# EAGLE design whoop-v2.0-F3 (EAGLE 6.4)
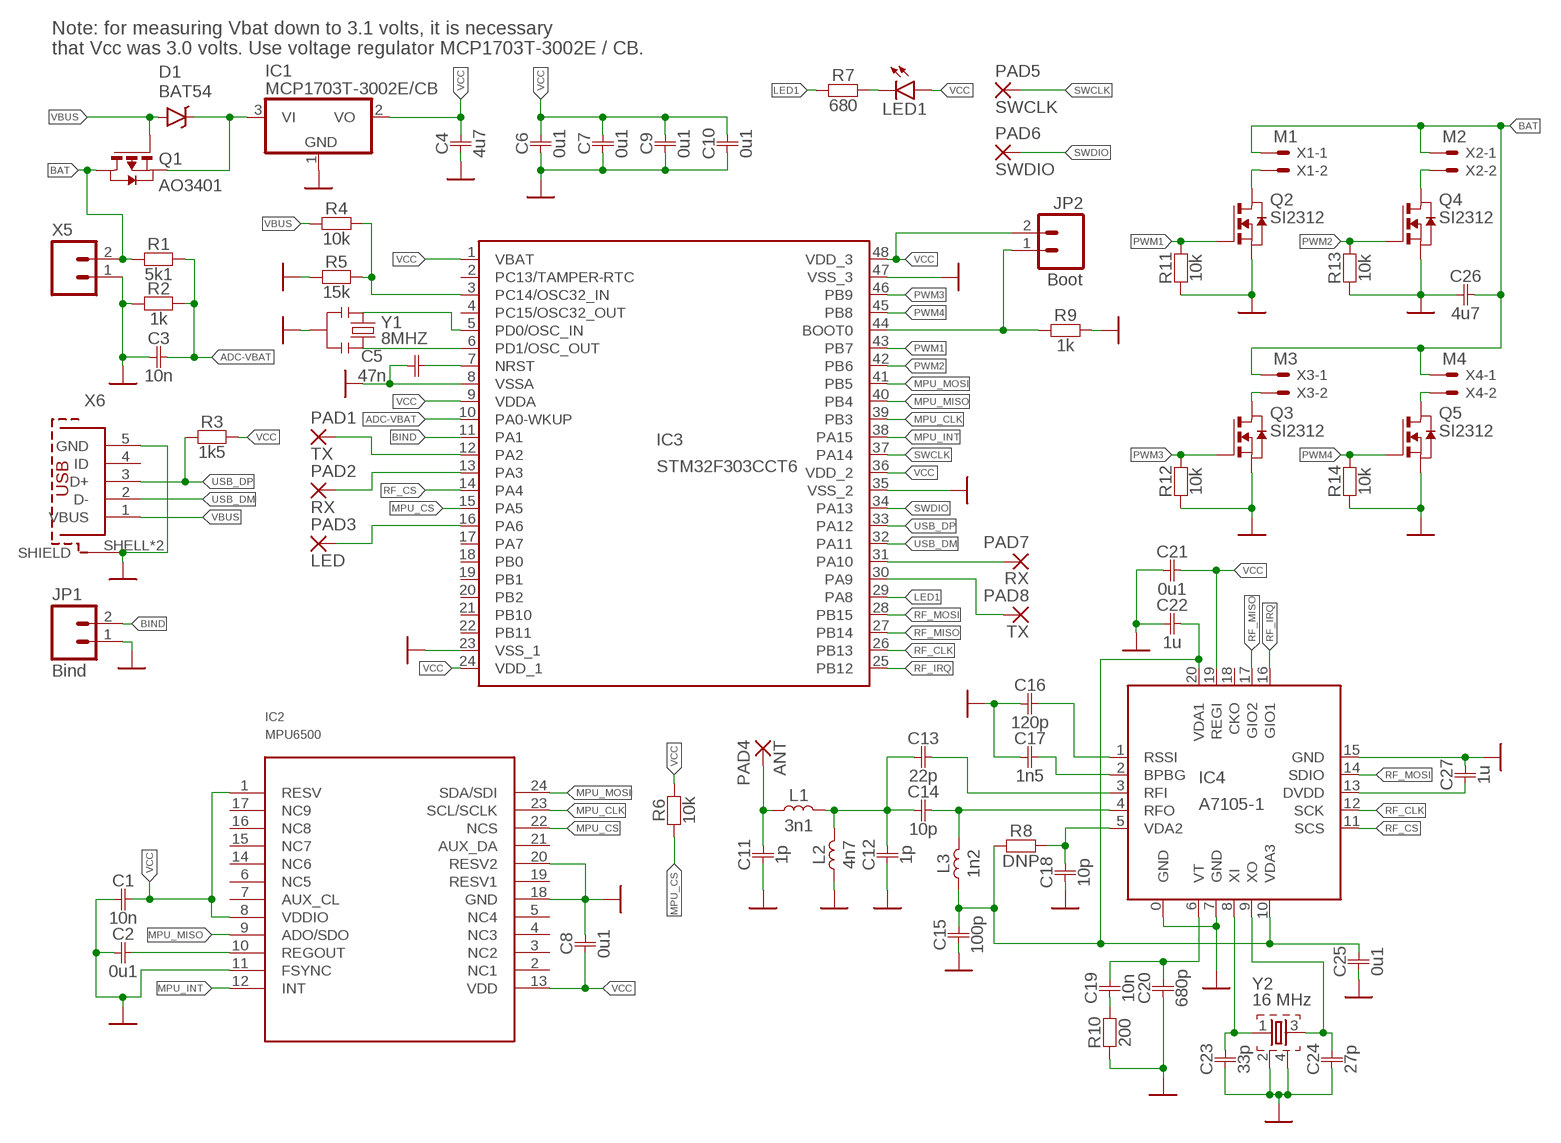
[diagram p0: schematic, sheet 1]

## Parts
C1  10n  C0402  [0402]
C2  0u1  C0402  [0402]
C3  10n  C0402  [0402]
C4  4u7  C0805  [0805]
C5  47n  C0402  [0402]
C6  0u1  C0402  [0402]
C7  0u1  C0402  [0402]
C8  0u1  C0402  [0402]
C9  0u1  C0402  [0402]
C10  0u1  C0402  [0402]
C11  1p  C0402  [0402]
C12  1p  C0402  [0402]
C13  22p  C0402  [0402]
C14  10p  C0402  [0402]
C15  100p  C0402  [0402]
C16  120p  C0402  [0402]
C17  1n5  C0402  [0402]
C18  10p  C0402  [0402]
C19  10n  C0402  [0402]
C20  680p  C0402  [0402]
C21  0u1  C0402  [0402]
C22  1u  C0402  [0402]
C23  33p  C0402  [0402]
C24  27p  C0402  [0402]
C25  0u1  C0402  [0402]
C26  4u7  C0805  [0805]
C27  1u  C0402  [0402]
D1  BAT54  BAT20JFILM  [SOD-323]
IC1  MCP1703T-3002E/CB  MCP1703CB  [SOT23]
IC2  MPU6500  MPU-9250  [LEAD-QFN24]
IC3  STM32F303CCT6  STM32F103C8  [LQFP48]
IC4  A7105-1  [QFN20-1]
JP1  Bind  M021.27MM  [1X02_1.27MM]
JP2  Boot  M021.27MM  [1X02_1.27MM]
L1  3n1  L0402  [0402]
L2  4n7  L0402  [0402]
L3  1n2  L0402  [0402]
LED1  LED-RED0603  [LED-0603]
PAD1  TX  SMD2SMD-R0,635  [SMD_R0,635]
PAD2  RX  1/0,6  [1/0,6]
PAD3  LED  1/0,6  [1/0,6]
PAD4  ANT  1/0,6  [1/0,6]
PAD5  SWCLK  SMD2SMD-R0,635  [SMD_R0,635]
PAD6  SWDIO  SMD2SMD-R0,635  [SMD_R0,635]
PAD7  RX  1/0,6  [1/0,6]
PAD8  TX  1/0,6  [1/0,6]
Q1  AO3401  PMOSSOT23  [SOT-23]
Q2  SI2312  NMOSSOT23  [SOT-23]
Q3  SI2312  NMOSSOT23  [SOT-23]
Q4  SI2312  NMOSSOT23  [SOT-23]
Q5  SI2312  NMOSSOT23  [SOT-23]
R1  5k1  R0402  [0402]
R2  1k  R0402  [0402]
R3  1k5  R0402  [0402]
R4  10k  R0402  [0402]
R5  15k  R0402  [0402]
R6  10k  R0402  [0402]
R7  680  R0402  [0402]
R8  DNP  R0402  [0402]
R9  1k  R0402  [0402]
R10  200  R0402  [0402]
R11  10k  R0402  [0402]
R12  10k  R0402  [0402]
R13  10k  R0402  [0402]
R14  10k  R0402  [0402]
X1  M1  53047-02  [53047-02]
X2  M2  53047-02  [53047-02]
X3  M3  53047-02  [53047-02]
X4  M4  53047-02  [53047-02]
X5  M022MM  [1X02_2MM]
X6  614105150721  [614105150721]
Y1  8MHZ  RESONATOR8MHZ  [RESONATOR-SMD]
Y2  16 MHz  FA-3225  [FA-20H]

## Nets
ADC-VBAT: C3.P$2 IC3.10(PA0-WKUP) R1.P$1 R2.P$1
BAT: C26.P$2 Q1.1(D) R1.P$2 X1.1 X2.1 X3.1 X4.1 X5.2
BIND: IC3.11(PA1) JP1.2
GND: C1.P$1 C2.P$1 C3.P$1 C4.P$1 C5.P$1 C6.P$1 C7.P$1 C8.P$2 C9.P$1 C10.P$1 C11.P$1 C12.P$1 C15.P$1 C16.P$1 C17.P$1 C18.P$1 C20.P$1 C21.P$1 C22.P$1 C23.P$1 C24.P$1 C25.P$1 C26.P$1 C27.P$2 IC1.1(GND) IC2.11(FSYNC) IC2.18(GND) IC2.20(RESV2) IC3.8(VSSA) IC3.23(VSS_1) IC3.35(VSS_2) IC3.47(VSS_3) IC4.0(GND) IC4.7(GND) IC4.15(GND) JP1.1 L2.P$1 Q2.2(S) Q3.2(S) Q4.2(S) Q5.2(S) R2.P$2 R5.P$2 R9.P$2 R10.P$1 R11.P$1 R12.P$1 R13.P$1 R14.P$1 X5.1 X6.5(GND) X6.SHELL1(SHIELD) X6.SHELL(SHIELD) Y1.2 Y2.2 Y2.4
LED1: IC3.29(PA8) R7.P$1
M1+: Q2.1(D) X1.2
M2+: Q4.1(D) X2.2
M3+: Q3.1(D) X3.2
M4+: Q5.1(D) X4.2
MPU_CLK: IC2.23(SCL/SCLK) IC3.39(PB3)
MPU_CS: IC2.22(NCS) IC3.15(PA5) R6.P$1
MPU_INT: IC2.12(INT) IC3.38(PA15)
MPU_MISO: IC2.9(ADO/SDO) IC3.40(PB4)
MPU_MOSI: IC2.24(SDA/SDI) IC3.41(PB5)
N$1: C13.P$2 IC4.3(RFI)
N$2: C12.P$2 C13.P$1 C14.P$1 L1.P$2 L2.P$2
N$3: C2.P$2 IC2.10(REGOUT)
N$4: C14.P$2 IC4.4(RFO) L3.P$1
N$5: C23.P$2 IC4.8(XI) Y2.1
N$6: C24.P$2 IC4.9(XO) Y2.3
N$7: C17.P$2 IC4.2(BPBG)
N$8: C16.P$2 IC4.1(RSSI)
N$9: C19.P$2 C20.P$2 IC4.6(VT)
N$10: C27.P$1 IC4.13(DVDD)
N$11: C19.P$1 R10.P$2
N$12: C15.P$2 C22.P$2 C25.P$2 IC4.10(VDA3) IC4.20(VDA1) L3.P$2 R8.P$1
N$13: IC3.6(PD1/OSC_OUT) Y1.3
N$14: C18.P$2 IC4.5(VDA2) R8.P$2
N$15: LED1.C R7.P$2
N$16: IC3.12(PA2) PAD1.1(P)
N$17: IC3.3(PC14/OSC32_IN) R4.P$2 R5.P$1
N$18: IC3.13(PA3) PAD2.1(P)
N$19: IC3.44(BOOT0) JP2.1 R9.P$1
N$20: C11.P$2 L1.P$1 PAD4.1(P)
N$21: IC3.31(PA10) PAD7.1(P)
N$22: IC3.16(PA6) PAD3.1(P)
N$23: IC3.30(PA9) PAD8.1(P)
N$33: IC3.5(PD0/OSC_IN) Y1.1
N$36: D1.C IC1.3(VI) Q1.2(S)
N$37: C5.P$2 IC3.7(NRST)
PWM1: IC3.43(PB7) Q2.3(G) R11.P$2
PWM2: IC3.42(PB6) Q4.3(G) R13.P$2
PWM3: IC3.46(PB9) Q3.3(G) R12.P$2
PWM4: IC3.45(PB8) Q5.3(G) R14.P$2
RF_CLK: IC3.26(PB13) IC4.12(SCK)
RF_CS: IC3.14(PA4) IC4.11(SCS)
RF_IRQ: IC3.25(PB12) IC4.16(GIO1)
RF_MISO: IC3.27(PB14) IC4.17(GIO2)
RF_MOSI: IC3.28(PB15) IC4.14(SDIO)
SWCLK: IC3.37(PA14) PAD5.1(P)
SWDIO: IC3.34(PA13) PAD6.1(P)
USB_DM: IC3.32(PA11) X6.2(D-)
USB_DP: IC3.33(PA12) R3.P$2 X6.3(D+)
VBUS: D1.A Q1.3(G) R4.P$1 X6.1(VBUS)
VCC: C1.P$2 C4.P$2 C6.P$2 C7.P$2 C8.P$1 C9.P$2 C10.P$2 C21.P$2 IC1.2(VO) IC2.1(RESV) IC2.8(VDDIO) IC2.13(VDD) IC3.1(VBAT) IC3.9(VDDA) IC3.24(VDD_1) IC3.36(VDD_2) IC3.48(VDD_3) IC4.19(REGI) JP2.2 LED1.A R3.P$1 R6.P$2
Unconnected: IC2.2(NC1) IC2.3(NC2) IC2.4(NC3) IC2.5(NC4) IC2.6(NC5) IC2.7(AUX_CL) IC2.14(NC6) IC2.15(NC7) IC2.16(NC8) IC2.17(NC9) IC2.19(RESV1) IC2.21(AUX_DA) IC3.2(PC13/TAMPER-RTC) IC3.4(PC15/OSC32_OUT) IC3.17(PA7) IC3.18(PB0) IC3.19(PB1) IC3.20(PB2) IC3.21(PB10) IC3.22(PB11) IC4.18(CKO) X6.4(ID)

## Notes on the sheet
- Note: for measuring Vbat down to 3.1 volts, it is necessary
  that Vcc was 3.0 volts. Use voltage regulator MCP1703T-3002E / CB.

## Library data of the parts
C1-C27 = RC.v2:C
D1 = SparkFun-DiscreteSemi:BAT20JFILM: 23V, 1A Schottky diode, SOD-323 package; PROD_ID: DIO-11623; VALUE: BAT20JFILM
IC1 = semi:MCP1703: 250 mA, 16V, Low Quiescent Current LDO Regulator Source: http://ww1.microchip.com/downloads/en/DeviceDoc/22049b.pdf
IC2 = invensense:MPU-9250
IC3 = cc3d:STM32F103C8: STM32F103C8 edit this description Auto generated by make-symbol-device-package-bsdl.ulp Rev. 43 Source: STM32F103C8.txt
IC4 = A7105:A7105
JP1 JP2 X5 = conn:M02: Standard 2-pin 0.1" header. Use with - straight break away headers ( PRT-00116) - right angle break away headers (PRT-00553) - swiss pins (PRT-00743) - machine pins (PRT-00117) - female headers (PRT-00115) Molex polarized connector foot print use with: PRT-08233 with associated crimp pins and housings. 2.54_SCREWTERM for use with PRT-10571. 3.5mm Screw Terminal footprints for PRT-08084 5mm Screw Terminal footprints for use with PRT-08432
L1-L3 = RC.v2:L
LED1 = led:LED-RED: Assorted Red LEDs LilyPad 1206- DIO-09912 1206- DIO-00809 0603- DIO-00819; PROD_ID: DIO-00819; VALUE: RED
PAD1 PAD5 PAD6 = pad:SMD2: SMD PAD
PAD2-PAD4 PAD7 PAD8 = pad:1/0,6
Q1 = cc3d:PMOSSOT23: MOS FET; OC_FARNELL: unknown; OC_NEWARK: unknown
Q2-Q5 = cc3d:NMOSSOT23: MOS FET; OC_FARNELL: unknown; OC_NEWARK: unknown
R1-R14 = RC.v2:R
X1-X4 = con-molex:53?-02: CONNECTOR wire to board 1.25 mm (.049 inch) pitch header; MF: MOLEX; MPN: 53047-0210; OC_FARNELL: 9733051; OC_NEWARK: 57H4701
X6 = micro-usb:614105150721: WR-COM_USB_Micro Type B_Vertical_THT; Micro Type B Vertical THT- Tape & Reel not for Pick & Place machine Code : Con_I-O_COM_USB_2.0_B_614105150721_614105150721 <http://katalog.we-online.de/media/images/eican/Con_I-O_COM_USB_2.0_B_614105150721_pf2.jpg> Details see: http://katalog.we-online.de/em/datasheet/614105150721.pdf Created 12/08/2014, Dan Xu 2014 (C) Wurth Elektronik
Y1 = resonator:RESONATOR: Resonator Small SMD resonator. Used, eg, on the Arduino Pro/ Pro Mini boards. 8MHz- XTAL-08895 16MHz- XTAL-08900; PROD_ID: XTAL-08895
Y2 = thermo:FA-: MHz RANGE CRYSTAL UNIT Source: Epson Toyocom

## Board
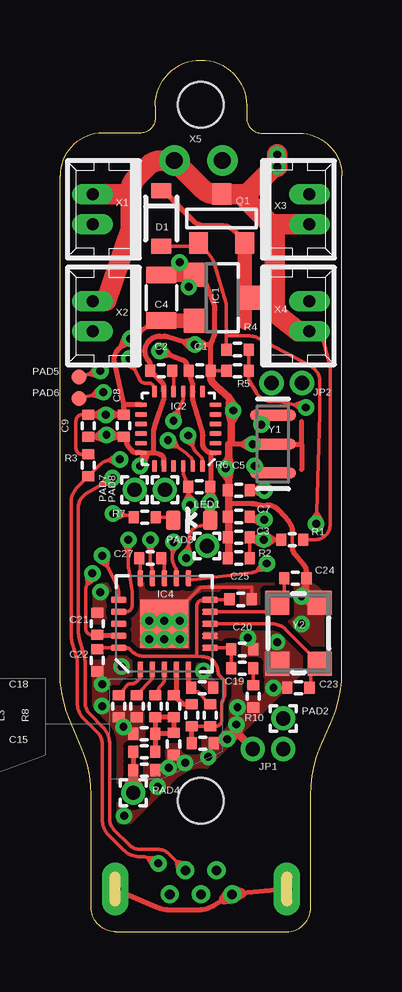
[diagram p1: board, top side]
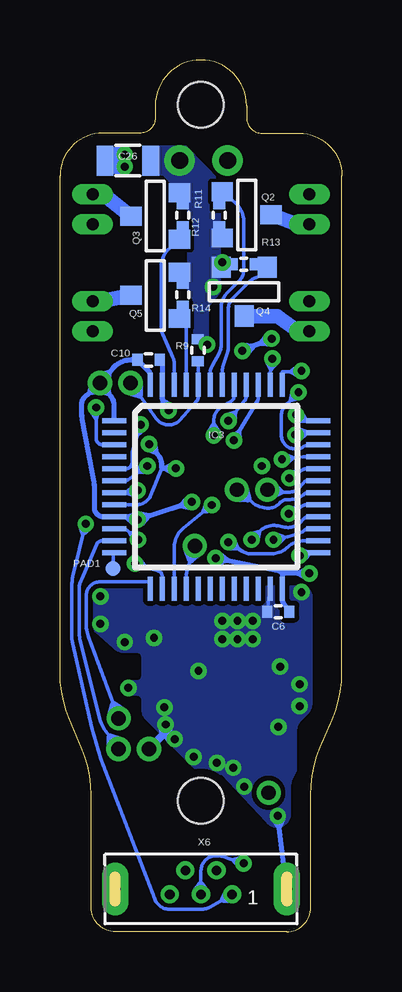
[diagram p2: board, bottom side, seen from below]

Size 11.75 x 36.32 mm. Coordinates in mm from the lower left corner, seen from the top.
Outline: 8.41,33.27 9.97,33.27 arc-90 11.75,31.5 11.75,10.82 arc-23 11.34,8.82 10.85,7.69 arc23 10.45,5.69 10.45,1 arc-90 9.45,0 2.3,0 arc-90 1.3,1 1.3,5.69 arc23 0.89,7.69 0.41,8.82 arc-23 0,10.82 0,31.5 arc-90 1.78,33.27 3.33,33.27 arc90 3.97,33.91 3.97,34.42 arc-180 7.78,34.42 7.78,33.91 arc90 8.41,33.27
Copper layers (1*16): Top 0.0356mm / dielectric 1.5011mm / Bottom 0.0356mm
Design rules "oshpark-2layer": minimum track width 6mil, minimum drill 13mil, track to track 6mil, track to pad 6mil, pad to pad 6mil, via to via 6mil, smd to smd 6mil, copper to edge 15mil, drill to drill 6mil, minimum pad ring 7mil, minimum via ring 7mil, stop-mask expansion 0mil, vias tented up to drill 30mil, thermal gap 10mil
Holes 1.9 mm at 5.87,34.46 5.87,5.46

### Footprints (pad centres in the part's own frame; a part is rotated, then mirrored left to right if it is on the bottom)
0402 = smd 0.42 x 0.5: P$1 -0.46,0; P$2 0.46,0
0805 = smd 0.7 x 1.25: P$1 -0.95,0; P$2 0.95,0
SOD-323 = smd 0.63 x 0.83: A 1.15,0; C -1.15,0
SOT23 = smd 1 x 1: 1 -0.95,-1.1; 2 0.95,-1.1; 3 0,1.1
LEAD-QFN24 = smd 0.5 x 0.2: 1 -1.549,1; 2 -1.549,0.6; 3 -1.549,0.2; 4 -1.549,-0.2; 5 -1.549,-0.6; 6 -1.549,-1; 13 1.549,-1; 14 1.549,-0.6; 15 1.549,-0.2; 16 1.549,0.2; 17 1.549,0.6; 18 1.549,1 | smd 0.2 x 0.5: 7 -1,-1.549; 8 -0.6,-1.549; 9 -0.2,-1.549; 10 0.2,-1.549; 11 0.6,-1.549; 12 1,-1.549; 19 1,1.549; 20 0.6,1.549; 21 0.2,1.549; 22 -0.2,1.549; 23 -0.6,1.549; 24 -1,1.549
LQFP48 = smd 0.2 x 1: 1 -2.75,-4.25; 2 -2.25,-4.25; 3 -1.75,-4.25; 4 -1.25,-4.25; 5 -0.75,-4.25; 6 -0.25,-4.25; 7 0.25,-4.25; 8 0.75,-4.25; 9 1.25,-4.25; 10 1.75,-4.25; 11 2.25,-4.25; 12 2.75,-4.25; 25 2.75,4.25; 26 2.25,4.25; 27 1.75,4.25; 28 1.25,4.25; 29 0.75,4.25; 30 0.25,4.25; 31 -0.25,4.25; 32 -0.75,4.25; 33 -1.25,4.25; 34 -1.75,4.25; 35 -2.25,4.25; 36 -2.75,4.25 | smd 1 x 0.2: 13 4.25,-2.75; 14 4.25,-2.25; 15 4.25,-1.75; 16 4.25,-1.25; 17 4.25,-0.75; 18 4.25,-0.25; 19 4.25,0.25; 20 4.25,0.75; 21 4.25,1.25; 22 4.25,1.75; 23 4.25,2.25; 24 4.25,2.75; 37 -4.25,2.75; 38 -4.25,2.25; 39 -4.25,1.75; 40 -4.25,1.25; 41 -4.25,0.75; 42 -4.25,0.25; 43 -4.25,-0.25; 44 -4.25,-0.75; 45 -4.25,-1.25; 46 -4.25,-1.75; 47 -4.25,-2.25; 48 -4.25,-2.75
QFN20-1 = smd 2 x 2: 0 0,0 | smd 0.65 x 0.25: 1 -1.9,1; 2 -1.9,0.5; 3 -1.9,0; 4 -1.9,-0.5; 5 -1.9,-1; 11 1.9,-1; 12 1.9,-0.5; 13 1.9,0; 14 1.9,0.5; 15 1.9,1 | smd 0.25 x 0.65: 6 -1,-1.9; 7 -0.5,-1.9; 8 0,-1.9; 9 0.5,-1.9; 10 1,-1.9; 16 1,1.9; 17 0.5,1.9; 18 0,1.9; 19 -0.5,1.9; 20 -1,1.9
1X02_1.27MM = drill 0.6 pad 1.016: 1 0,0; 2 1.27,0
LED-0603 = smd 0.8 x 0.6: A 0,-0.777; C 0,0.777
SMD_R0,635 = smd 0.635 x 0.635: 1 0,0
1/0,6 = drill 0.6 pad 1: 1 0,0
SOT-23 = smd 0.787 x 0.889: 1 0.025,-1.016; 2 -0.94,1.016; 3 0.991,1.016
53047-02 = drill 0.5 pad 0.698 long: 1 0.625,0.45; 2 -0.625,0.45
1X02_2MM = drill 0.7 pad 1.27: 1 0,0; 2 2,0
614105150721 = drill 0.4: 1 -1.3,0.22; 2 -0.65,-0.78; 3 0,0.22; 4 0.65,-0.78; 5 1.3,0.22 | drill 0.45 pad 1.1 long: SHELL -3.575,0; SHELL1 3.575,0
RESONATOR-SMD = smd 0.45 x 1.905: 1 -1.2,0; 2 0,0; 3 1.2,0
FA-20H = smd 1 x 1: 1 -1.27,-0.889; 2 1.27,-0.889; 3 1.27,0.889; 4 -1.27,0.889

### Placement (x,y rotation side)
C1  5.82,23.37 180 top
C2  4.22,23.37 0 top
C3  7.45,16.43 0 top
C4  4.22,26.42 270 top
C5  7.45,18.39 0 top
C6  2.65,13.34 0 bottom
C7  7.45,17.3 0 top
C8  2.65,21.08 270 top
C9  1.17,21.08 90 top
C10  8.06,23.83 180 bottom
C11  3.51,6.73 180 top
C12  4.73,7.82 90 top
C13  3.97,9.4 90 top
C14  4.73,9.4 90 top
C15  5.95,7.85 180 top
C16  2.44,9.4 90 top
C17  3.21,9.4 90 top
C18  5.92,10.16 180 top
C19  7.6,10.97 180 top
C20  7.6,11.76 180 top
C21  1.56,12.83 270 top
C22  1.56,11.3 90 top
C23  9.94,10.16 0 top
C24  9.81,14.73 180 top
C25  7.52,13.84 180 top
C26  8.92,32.13 180 bottom
C27  3.76,15.57 180 top
D1  4.22,29.72 270 top
IC1  6.76,26.42 270 top
IC2  4.93,20.95 180 top
IC3  5.24,18.54 270 bottom
IC4  4.35,12.83 90 top
JP1  8.03,7.62 0 top
JP2  8.81,22.86 0 top
L1  3.51,7.49 0 top
L2  3.51,8.26 0 top
L3  5.49,9.02 270 top
LED1  5.49,17.14 90 top
PAD1  9.53,15.14 0 bottom
PAD2  9.3,8.89 0 top
PAD3  6.13,16.08 0 top
PAD4  3.05,5.79 0 top
PAD5  0.79,23.11 0 top
PAD6  0.79,22.23 180 top
PAD7  3.1,18.41 0 top
PAD8  4.37,18.41 0 top
Q1  6.76,29.72 180 top
Q2  3.97,29.84 90 bottom
Q3  7.78,29.84 270 bottom
Q4  4.1,26.67 0 bottom
Q5  7.78,26.54 270 bottom
R1  9.68,16.33 0 top
R2  7.45,15.57 180 top
R3  1.17,19.43 270 top
R4  7.4,24.26 0 top
R5  7.4,23.37 180 top
R6  5.8,18.54 0 top
R7  3.54,17.27 0 top
R8  6.25,9.02 90 top
R9  6,24.23 90 bottom
R10  8.06,9.8 90 top
R11  5.11,29.84 90 bottom
R12  6.63,29.84 270 bottom
R13  4.1,27.81 0 bottom
R14  6.63,26.54 270 bottom
X1  1.81,30.1 90 top
X2  1.81,25.65 90 top
X3  9.94,30.1 270 top
X4  9.94,25.65 270 top
X5  6.76,32.13 180 top
X6  5.87,1.78 180 bottom
Y1  8.87,20.32 270 top
Y2  9.94,12.45 90 top

### Tracks (layer width: path | path; a pad name or v marks a point on that pad's centre or on a via)
ADC-VBAT  (via drill 0.33 pad 0.69)
  Top 0.152: v8.49,16.33 7.99,16.33 | 7.99,16.33 7.96,16.33 C3.P$2 R2.P$1 | R1.P$1 8.98,16.33 | 8.98,16.33 v8.49,16.33 | 7.99,16.33 8.35,16.11 v8.49,16.33 | 7.99,16.33 8.35,16.56 v8.49,16.33 | 8.98,16.33 8.63,16.56 v8.49,16.33 | 8.98,16.33 8.63,16.11 v8.49,16.33
  Bottom 0.152: IC3.10 9.03,16.79 v8.49,16.33 | v8.49,16.33 8.45,16.55 8.87,16.66 8.67,16.31 v8.49,16.33
BAT  (via drill 0.33 pad 0.69)
  Top 0.152: R1.P$2 10.62,16.33 arc90 11.26,16.97 11.26,23.44 arc15 11.23,23.7 10.89,24.95 X4.1
  Top 0.864: X2.1 1.94,26.29 2.95,29.27 2.95,30.73 | 2.95,30.73 2.95,30.88 arc-45 3.18,31.41 3.67,31.91 arc-45 4.21,32.13 X5.2 5.94,30.96 arc45 6.48,30.73 Q1.1 7.52,30.73 7.65,30.61 | X1.1 1.37,30.73 2.95,30.73 | X4.1 10.38,25.02 9.94,25.02 9.24,25.55 arc-52 8.95,26.16 8.95,29.31 8.78,29.47 | 8.78,29.47 7.65,30.61 | X3.1 8.78,29.47 | 7.65,30.61 8.92,31.88 v9.05,31.88 v9.05,32.38
  Bottom 0.61: v9.05,32.38 9.87,32.38 C26.P$2 9.87,31.88 v9.05,31.88
BIND
  Bottom 0.152: IC3.11 9.99,16.29 arc-67 10.22,16.14 10.85,14.69 arc-23 10.95,14.19 10.95,12.5 arc-14 10.92,12.2 10.1,8.88 arc-22 9.89,8.44 9.65,8.11 JP1.2
  Bottom 0.305: 9.65,8.11 9.19,7.96 JP1.2 9.66,7.62 9.65,8.11
GND  (via drill 0.33 pad 0.69)
  Top 0.152: IC4.15 3.35,15.59 C27.P$2 | C25.P$1 7.98,14.35 5.87,14.35 4.97,13.45 | 4.97,13.45 4.76,13.23 | 4.76,13.23 4.62,13.09 4.62,12.68 | 6.28,23.21 C1.P$1 R5.P$2 | 9.68,16.64 9.68,16 | v6.96,8.03 7.21,8.16 | 7.21,8.16 7.4,8.26 7.41,8.24 | 7.41,8.24 7.49,8.16 | 7.49,8.16 7.61,8.04 JP1.1 | 4.76,13.23 4.34,13.22 v4.35,12.95 4.6,12.85 4.76,13.23 | 4.97,13.45 4.76,13.09 v4.98,12.95 5.21,13.1 4.97,13.45 | 7.41,8.24 7,8.29 v6.96,8.03 | 7.41,8.24 7.19,7.88 v6.96,8.03 | 7.21,8.16 7.53,8.44 v7.35,8.64 | 7.21,8.16 7.09,8.56 v7.35,8.64 | 7.49,8.16 7.6,8.56 v7.35,8.64 | 7.49,8.16 7.17,8.43 v7.35,8.64
  Top 0.203: 2.43,20.62 C8.P$2 2.77,20.52 2.77,20.41 arc38 2.83,20.25 2.99,20.05 arc52 3.19,19.95 IC2.18 3.62,19.95 | 2.43,20.62 1.94,20.62 | C9.P$1 1.45,20.62 | 1.45,20.62 1.94,20.62 | 1.94,20.62 v1.94,20.7 | 3.89,19.95 3.89,20.74 arc-19 3.96,21.16 4.33,22.21 IC2.11 4.33,22.69 arc45 4.26,22.87 C2.P$1 3.76,23.62 arc37 3.71,23.77 3.65,23.86 arc-37 3.54,24.18 arc-47 3.74,24.65 arc-43 4.16,24.82 4.33,24.82 arc-17 4.51,24.79 5.14,24.6 | 3.62,19.95 3.89,19.95 | IC2.20 4.33,19.65 arc76 4.14,19.89 3.89,19.95 | 5.14,24.6 v5.62,24.46 | C1.P$1 6.28,24.46 | 6.28,24.46 6.11,24.46 | 6.11,24.46 v5.62,24.46 | 6.28,24.46 6.41,24.78 arc21 6.46,25.06 6.46,25.91 arc22 6.4,26.2 6.03,27.15 IC1.1 v5.37,26.87 | v8.03,20.32 7.54,20.32 | 7.54,20.32 7.04,20.32 6.99,20.32 | v8.03,20.32 8.53,20.32 | 8.53,20.32 Y1.2 10.06,20.32 | 10.06,20.32 10.06,21.26 | 10.06,20.32 10.06,19.25 | 3.62,19.95 3.62,19.84 arc-6 3.64,19.94 | 3.64,19.94 arc-29 3.56,19.7 v3.33,19.41 | 9.68,16.64 9.68,16.68 arc41 9.52,17.1 9.11,17.56 arc49 8.63,17.78 8.38,17.78 arc-16 8.2,17.8 8.19,17.81 arc16 8.02,17.83 7.04,17.83 7.04,17.86 | 9.68,16 arc40 9.78,15.73 10.12,15.34 arc-40 10.27,14.93 C24.P$1 10.27,14.42 | 10.27,14.42 10.27,13.72 10.49,13.72 | 10.49,13.72 Y2.2 | X6.SHELL1 7.57,1.6 X6.5 6.83,1.35 6.39,1.08 arc-30 5.76,0.91 4.56,0.91 arc-23 4.06,1.02 X6.SHELL | C3.P$1 7.04,16.38 | C7.P$1 7.02,17.3 7.04,17.27 | C5.P$1 7.04,18.39 7.04,18.36 | v6.91,19.3 7.04,19.3 | v7.22,21.72 7.14,21.72 | 7.54,20.32 7.91,20.11 v8.03,20.32 | 7.54,20.32 7.91,20.53 v8.03,20.32 | 8.53,20.32 8.15,20.53 v8.03,20.32 | 8.53,20.32 8.15,20.11 v8.03,20.32 | 10.27,14.42 9.92,14.17 v10.06,13.97
  Top 0.203: 10.27,14.42 10.3,13.99 v10.06,13.97 | 10.49,13.72 10.27,14.09 v10.06,13.97 | 10.49,13.72 10.06,13.73 v10.06,13.97 | 2.43,20.62 2.09,20.89 v1.94,20.7 | 2.43,20.62 2.02,20.47 v1.94,20.7 | 1.45,20.62 1.85,20.47 v1.94,20.7 | 1.45,20.62 1.79,20.89 v1.94,20.7 | 3.64,19.94 3.44,19.81 3.33,19.63 3.23,19.62 v3.33,19.41 | 3.64,19.94 3.47,19.41 v3.33,19.41 | 5.14,24.6 5.45,24.29 v5.62,24.46 | 5.14,24.6 5.57,24.7 v5.62,24.46 | 6.11,24.46 5.74,24.67 v5.62,24.46 | 6.11,24.46 5.74,24.25 v5.62,24.46 | v5.37,26.87 5.25,27.08 5.62,27.3 5.61,26.87 v5.37,26.87
  Top 0.305: 7.08,22.19 arc14 7.02,22.26 6.54,22.7 6.39,22.85 arc-45 6.28,23.12 C1.P$1 | 7.08,22.19 arc-33 7.14,21.98 7.14,21.72 7.14,21.23 | 7.14,21.23 7.14,20.45 7.04,20.32 7.04,19.78 | 7.04,19.78 7.04,19.3 7.04,18.83 | 7.04,18.83 7.04,18.36 7.04,17.86 7.04,17.27 7.04,16.38 7.04,15.6 R2.P$2 | 7.04,19.78 6.81,19.42 v6.91,19.3 | 7.04,19.78 7.1,19.33 v6.91,19.3 | 7.04,18.83 7.1,19.28 v6.91,19.3 | 7.04,18.83 6.76,19.19 v6.91,19.3 | 7.08,22.19 7.03,21.74 v7.22,21.72 | 7.08,22.19 7.37,21.84 v7.22,21.72 | 7.14,21.23 7.38,21.62 v7.22,21.72 | 7.14,21.23 7.03,21.67 v7.22,21.72 | 7.61,8.04 8.06,7.57 JP1.1 7.32,8.35 7.61,8.04
  Top 0.406: X6.5 7.23,1.72 7.57,1.6 7.26,1.41 X6.5 | X6.5 7.19,1.38 6.83,1.35 7.03,1.65 X6.5
  Top 0.61: IC1.1 C4.P$1
  Bottom 0.152: C10.P$1 7.6,23.95 | IC3.23 2.98,14.41 C6.P$1 | IC3.8 8.55,17.79 arc-68 7.96,18.19 7.5,19.3 | R9.P$2 5.93,24.69 v5.62,24.46 | R11.P$1 Q2.2 | R14.P$1 Q5.2 | R13.P$1 v4.98,27.89 Q4.2 | R12.P$1 Q3.2 | JP1.1 7.61,8.04 7.49,8.16 | 7.49,8.16 7.41,8.24 | 7.41,8.24 7.4,8.26 7.21,8.16 | 7.21,8.16 v6.96,8.03 | 7.41,8.24 7,8.29 v6.96,8.03 | 7.41,8.24 7.19,7.88 v6.96,8.03 | 7.49,8.16 7.6,8.56 v7.35,8.64 | 7.49,8.16 7.17,8.43 v7.35,8.64 | 7.21,8.16 7.53,8.44 v7.35,8.64 | 7.21,8.16 7.09,8.56 v7.35,8.64
  Bottom 0.203: C10.P$1 7.49,23.72 IC3.47 7.49,22.26 arc-25 7.46,22.15 | IC3.35 1.45,20.79 | 1.45,20.79 1.77,20.79 v1.94,20.7 | v7.22,21.72 7.46,22.13 arc4 7.46,22.15 | 7.72,19.94 7.63,19.83 arc38 7.5,19.44 7.5,19.3 7.41,19.3 | 7.72,19.94 v8.03,20.32 | v6.91,19.3 7.41,19.3 | X6.SHELL v2.67,4.83 | 7.72,19.94 8.12,20.09 v8.03,20.32 | 7.72,19.94 7.79,20.36 v8.03,20.32 | 1.45,20.79 1.78,20.52 v1.94,20.7 | 1.45,20.79 1.86,20.93 v1.94,20.7 | 7.41,19.3 7.03,19.52 v6.91,19.3 | 7.41,19.3 7.03,19.09 v6.91,19.3 | 7.46,22.15 7.09,21.92 v7.22,21.72 | 7.46,22.15 7.46,21.72 v7.22,21.72 | v2.67,4.83 2.87,4.68 2.61,4.33 2.45,4.74 v2.67,4.83
  Bottom 0.305: 7.61,8.04 7.93,7.69 JP1.1 7.32,8.35 7.61,8.04
  other vias: 4.98,12.19 2.57,11.05 9.05,12.07 7.83,12.24 10.06,12.83 8.9,10.16 3.71,12.19 4.35,12.19 3.71,12.95 5.97,10.87 1.68,14.15 2.65,8.53 1.76,9.4 1.76,10.31 5.21,7.04 4.53,6.83 4.07,6.05 7.4,9.35 6.18,7.29
  pour Bottom (no thermals): 7.65,32.69 6.51,32.69 5.11,31.24 5.11,26.67 5.62,26.04 5.62,24.64 6.13,24.64 6.13,26.29 6.38,26.54 6.38,30.48 7.45,31.57 7.7,31.57
  pour Top (isolate 0.203, no thermals): 10.95,11.68 10.95,13.84 arc90 10.32,14.48 1.94,14.48 arc90 1.3,13.84 1.3,9.27 1.94,8.64 1.94,6.73 2.19,6.22 2.19,4.57 2.95,4.57 4.8,6.42 arc-45 5.25,6.6 5.61,6.6 arc45 6.06,6.79
  pour Bottom (isolate 0.203, no thermals): 4.98,6.6 3.09,4.59 arc-135 2.19,4.86 2.19,6.07 arc27 2.12,6.36 2,6.6 arc-27 1.94,6.88 1.94,8.37 arc45 1.75,8.82 1.49,9.09 arc-45 1.3,9.53 1.3,13.97 arc-90 1.68,14.35 10.19,14.35 10.45,14.1 10.45,12.99 arc-48 10.23,12.51 9.48,11.84 arc-42 9.06,11.68 8.54,11.68 arc90 8.29,11.43 8.29,10.67 arc90 8.54,10.41 8.92,10.41 8.92,9.91 8.54,9.91 arc90 8.29,9.65 8.29,9.28 arc-45 8.1,8.83 5.87,6.6
LED1  (via drill 0.33 pad 0.69)
  Top 0.152: v2.22,17.42 2.37,17.35 2.71,17.35 | 2.71,17.35 3.03,17.35 3.03,17.32 R7.P$1 | 2.71,17.35 2.39,17.62 v2.22,17.42 | 2.71,17.35 2.32,17.18 v2.22,17.42
  Bottom 0.152: IC3.29 1.48,17.79 arc-29 1.6,17.76 v2.22,17.42 | v2.22,17.42 1.98,17.3 1.78,17.66 2.2,17.69 v2.22,17.42
M1+
  Bottom 0.61: X1.2 1.81,29.46 Q2.1
M2+
  Bottom 0.61: X2.2 1.37,25.02 1.81,25.02 2.7,25.65 Q4.1
M3+
  Bottom 0.61: X3.2 9.94,30.73 Q3.1
M4+
  Bottom 0.61: X4.2 9.94,26.29 Q5.1
MPU_CLK  (via drill 0.33 pad 0.69)
  Top 0.152: v4.5,20.47 5.17,20 arc-10 5.34,19.86 5.46,19.74 arc-45 5.53,19.56 IC2.23 | v4.5,20.47 4.75,20.57 4.91,20.19 4.49,20.21 v4.5,20.47
  Bottom 0.152: IC3.39 3.49,22.24 arc31 3.52,22.11 4.25,20.9 | 4.25,20.9 v4.5,20.47 | 4.25,20.9 4.24,20.48 v4.5,20.47 | 4.25,20.9 4.6,20.66 v4.5,20.47
MPU_CS  (via drill 0.33 pad 0.69)
  Top 0.152: IC2.22 5.13,19.13 arc24 5.16,19.03 5.21,18.9 arc-24 5.24,18.79 5.24,18.67 R6.P$1 5.34,18.27 | 5.34,18.27 5.34,18.1 arc16 5.35,18.03 v5.42,17.78 | 5.34,18.27 5.17,17.89 v5.42,17.78 | 5.34,18.27 5.62,17.96 v5.42,17.78
  Bottom 0.152: v5.42,17.78 5.8,17.47 | 5.8,17.47 6.62,16.81 arc-51 6.99,16.03 IC3.15 | 5.8,17.47 5.64,17.87 v5.42,17.78 | 5.8,17.47 5.39,17.52 v5.42,17.78
MPU_INT  (via drill 0.33 pad 0.69)
  Top 0.152: IC2.12 3.93,22.72 3.87,22.79 arc45 3.69,22.86 3.54,22.86 arc-65 3.32,23.01 3.11,23.43 | 3.11,23.43 v2.9,23.88 | 3.11,23.43 3.17,23.84 v2.9,23.88 | 3.11,23.43 2.76,23.65 v2.9,23.88
  Bottom 0.152: v2.9,23.88 2.99,23.28 IC3.38 | v2.9,23.88 3.14,23.77 2.97,23.39 2.7,23.7 v2.9,23.88
MPU_MISO  (via drill 0.33 pad 0.69)
  Top 0.152: v4.73,21.29 5.11,22.12 arc24 5.13,22.23 IC2.9 | v4.73,21.29 4.58,21.51 4.94,21.74 4.99,21.32 v4.73,21.29
  Bottom 0.152: IC3.40 3.99,22.3 arc39 4.04,22.13 4.42,21.67 | 4.42,21.67 v4.73,21.29 | 4.42,21.67 4.46,21.26 v4.73,21.29 | 4.42,21.67 4.82,21.54 v4.73,21.29
MPU_MOSI  (via drill 0.33 pad 0.69)
  Top 0.152: v5.34,20.68 5.54,20.22 | 5.54,20.22 5.6,20.08 arc21 5.65,20.01 5.86,19.8 arc-45 5.93,19.62 IC2.24 | 5.54,20.22 5.6,20.63 v5.34,20.68 | 5.54,20.22 5.19,20.45 v5.34,20.68
  Bottom 0.152: IC3.41 4.49,22.33 arc58 4.61,22.11 5.04,21.85 arc-58 5.34,21.31 5.34,21.17 | 5.34,21.17 v5.34,20.68 | 5.34,21.17 5.12,20.82 v5.34,20.68 | 5.34,21.17 5.56,20.82 v5.34,20.68
N$1
  Top 0.152: IC4.3 4.35,10.52 arc-45 4.28,10.34 4.16,10.21 arc41 4.1,10.04 4.1,9.91 C13.P$2
N$2
  Top 0.203: L2.P$2 C13.P$1 C14.P$1 C12.P$2 4.73,8.26 L2.P$2 | L2.P$2 L1.P$2
N$3
  Top 0.152: IC2.10 4.73,23.37 C2.P$2
N$4
  Top 0.152: 4.85,9.98 C14.P$2
  Top 0.203: IC4.4 4.85,9.98 | L3.P$1 5.22,9.48 arc-45 5.04,9.55 C14.P$2
N$5
  Top 0.152: IC4.8 8.84,12.83 arc-45 9.41,12.59 Y2.1 10.45,11.18 10.45,10.16 C23.P$2
N$6
  Top 0.152: IC4.9 8.66,13.33 | 8.66,13.33 Y2.3 | C24.P$2 9.35,14.68 9.35,13.35 8.66,13.33
N$7
  Top 0.152: IC4.2 3.85,10.65 arc-45 3.78,10.48 3.59,10.29 3.46,10.14 C17.P$2
N$8
  Top 0.152: IC4.1 3.35,10.67 arc-48 3.27,10.48 3.18,10.4 arc-42 3.01,10.34 2.97,10.34 arc50 2.77,10.25 C16.P$2
N$9
  Top 0.152: IC4.6 7.05,11.83 C20.P$2 C19.P$2
N$10
  Top 0.152: IC4.13 4.35,15.57 C27.P$1
N$11
  Top 0.152: R10.P$2 C19.P$1
N$12
  Top 0.152: 5.7,11.48 3.47,11.48 arc-45 3.02,11.67 2.93,11.75 arc45 2.76,11.83 IC4.20 1.56,11.83 C22.P$2 | C25.P$2 7.05,13.83 IC4.10 5.96,13.83 arc45 5.78,13.75 5.77,13.74 arc45 5.7,13.56 5.7,11.48 | 5.7,11.48 5.92,11.46 5.95,11.46 arc-90 6.58,10.82 arc45 6.64,10.69 6.79,10.54 arc-45 6.86,10.36 6.86,9.9 arc-18 6.85,9.82 6.75,9.51 arc18 6.74,9.43 6.74,8.81 arc-90 6.48,8.56 R8.P$1 L3.P$2
  Top 0.203: C15.P$2 L3.P$2
N$13  (via drill 0.33 pad 0.69)
  Top 0.152: v8.11,19.41 8.23,19.12 8.51,19.12 | 8.51,19.12 Y1.3 | 8.51,19.12 8.36,19.51 v8.11,19.41 | 8.51,19.12 8.1,19.14 v8.11,19.41
  Bottom 0.152: IC3.6 9.05,18.79 arc-36 8.9,18.84 v8.11,19.41 | v8.11,19.41 8.36,19.51 8.51,19.12 8.1,19.14 v8.11,19.41
N$14
  Top 0.152: R8.P$2 6.08,9.63 5.87,9.9 arc54 5.67,10.01 5.49,10.01 5.46,10.06 C18.P$2
  Top 0.203: IC4.5 5.35,10.43 C18.P$2
N$15
  Top 0.152: R7.P$2 4.6,17.27 LED1.C
N$16
  Bottom 0.152: PAD1.1 9.53,15.79 IC3.12
N$17  (via drill 0.33 pad 0.69)
  Top 0.152: R4.P$2 R5.P$1 7.86,23.08 arc30 7.89,22.95 8.17,22.48 arc60 8.83,22.1 8.96,22.1 arc-14 9.39,22.05 9.76,21.95 | 9.76,21.95 10.19,21.84 v10.24,21.84 | 9.76,21.95 10.1,21.76 v10.24,21.84 | 9.76,21.95 10.15,22.09 v10.24,21.84
  Bottom 0.152: IC3.3 9.99,20.29 arc90 10.24,20.55 10.24,21.35 | 10.24,21.35 v10.24,21.84 | 10.24,21.35 10.47,21.7 v10.24,21.84 | 10.24,21.35 10.12,21.78 v10.24,21.84
N$18
  Bottom 0.152: IC3.13 7.99,14.58 10.09,14.58 arc-90 10.65,14.02 10.65,12.75 arc-20 10.57,12.31 9.51,9.45 PAD2.1
  Bottom 0.305: 9.51,9.45 9.11,9.18 PAD2.1 9.64,8.98 9.51,9.45
N$19
  Bottom 0.152: R9.P$1 5.99,23.77 IC3.44 5.99,22.28 arc41 6.05,22.11 6.74,21.33 arc103 7.73,21.38 8.45,22.38 JP2.1
  Bottom 0.305: 8.45,22.38 8.91,22.52 JP2.1 8.45,22.86 8.45,22.38
N$20
  Top 0.203: L1.P$1 C11.P$2 3.05,6.39 3.05,5.84 PAD4.1
  Top 0.406: 3.05,6.39 2.8,5.94 PAD4.1 3.31,5.94 3.05,6.39
N$21
  Bottom 0.152: IC3.31 1.43,18.79 arc-12 1.48,18.79 1.56,18.77 arc-3 1.73,18.54 arc51 2.22,18.31 2.27,18.31 arc4 2.51,18.32
  Bottom 0.203: 2.51,18.32 arc10 PAD7.1 | 2.51,18.32 2.95,18.1 PAD7.1 | 2.51,18.32 2.86,18.66 PAD7.1
N$22
  Bottom 0.152: IC3.16 6.49,14.81 arc17 6.46,15 PAD3.1
  Bottom 0.305: 6.3,15.51 6.46,15.97 PAD3.1 5.92,15.8 6.3,15.51
N$23
  Bottom 0.152: IC3.30 1.42,18.29 arc-45 1.6,18.22 1.63,18.19 arc38 2.24,18.01 arc-46 2.6,17.86 arc51 3.13,17.65 arc34 3.77,17.91 3.91,18.03 PAD8.1
  Bottom 0.305: 3.91,18.03 4.4,18.07 PAD8.1 4.04,18.5 3.91,18.03
N$33  (via drill 0.33 pad 0.69)
  Top 0.152: v8.39,21.13 8.47,21.52 8.7,21.52 | 8.7,21.52 Y1.1 | 8.7,21.52 8.3,21.38 v8.39,21.13 | 8.7,21.52 8.65,21.11 v8.39,21.13
  Bottom 0.152: IC3.5 9,19.29 arc-90 8.74,19.55 8.74,19.9 arc17 8.73,19.97 8.53,20.66 | 8.53,20.66 v8.39,21.13 | 8.53,20.66 8.64,21.06 v8.39,21.13 | 8.53,20.66 8.21,20.93 v8.39,21.13
N$36
  Top 0.203: Q1.2 7.65,28.75 7.65,28.83 7.29,29.19 arc45 6.75,29.41 6.07,29.41 arc-46 5.52,29.64 4.32,30.87 D1.C
  Top 0.61: Q1.2 7.7,26.42 | 7.7,26.42 IC1.3 | 7.7,26.42 7.7,25.4
N$37  (via drill 0.33 pad 0.69)
  Top 0.203: C5.P$2 8.02,18.39 | 8.02,18.39 v8.52,18.39 | 8.02,18.39 8.4,18.18 v8.52,18.39 | 8.02,18.39 8.4,18.6 v8.52,18.39
  Bottom 0.152: IC3.7 9,18.29 | 9,18.29 8.7,18.29 v8.52,18.39 | 9,18.29 8.7,18.58 v8.52,18.39 | 9,18.29 8.61,18.14 v8.52,18.39
PWM1
  Bottom 0.152: IC3.43 5.49,23.28 arc29 5.41,23.59 5.12,24.11 arc-29 5.04,24.42 5.04,25.95 arc45 4.74,26.66 4.28,27.12 arc-45 4.1,27.57 4.1,29.61 arc-49 4.44,30.37 Q2.3 R11.P$2
PWM2
  Bottom 0.152: IC3.42 4.99,23.34 arc18 4.96,23.53 4.78,24.11 arc-18 4.73,24.41 4.73,25.95 arc45 4.54,26.4 3.87,27.08 arc20 3.69,27.2 3.31,27.38 Q4.3 R13.P$2
PWM3
  Bottom 0.152: IC3.46 6.99,23.69 arc-24 7.04,23.95 7.47,24.9 arc24 7.52,25.16 7.52,27.72 arc48 7.19,28.47 Q3.3 R12.P$2
PWM4
  Bottom 0.152: IC3.45 6.48,25.55 Q5.3 R14.P$2
RF_CLK  (via drill 0.33 pad 0.69)
  Top 0.152: v4.73,16.23 4.68,15.74 | 4.68,15.74 4.68,15.72 4.68,15.55 arc32 4.78,15.21 4.82,15.15 arc-32 4.86,15.01 IC4.12 | 4.68,15.74 4.86,16.09 v4.73,16.23 | 4.68,15.74 4.64,16.16 v4.73,16.23
  Bottom 0.152: IC3.26 1.54,16.29 arc-40 2.27,16.03 arc44 2.93,15.75 3.8,15.75 arc33 4.15,15.85 v4.73,16.23 | v4.73,16.23 4.73,15.96 4.32,15.96 4.49,16.34 v4.73,16.23
RF_CS  (via drill 0.33 pad 0.69)
  Top 0.152: IC4.11 5.37,14.71 5.37,14.66 5.54,14.66 7.99,14.96 arc31 8.3,15.09 v8.62,15.34 | v8.62,15.34 8.64,15.08 8.22,15.04 8.44,15.41 v8.62,15.34
  Bottom 0.152: IC3.14 7.49,14.8 arc-73 7.67,15.04 v8.62,15.34 | v8.62,15.34 8.55,15.08 8.14,15.19 8.41,15.51 v8.62,15.34
RF_IRQ  (via drill 0.33 pad 0.69)
  Top 0.152: IC4.16 2.45,14.14 arc26 2.38,14.42 1.98,15.23 | 1.98,15.23 v1.76,15.67 | 1.98,15.23 2.02,15.64 v1.76,15.67 | 1.98,15.23 1.62,15.44 v1.76,15.67
  Bottom 0.152: IC3.25 1.28,15.79 | 1.28,15.79 1.51,15.79 v1.76,15.67 | 1.28,15.79 1.56,15.49 v1.76,15.67 | 1.28,15.79 1.67,15.93 v1.76,15.67
RF_MISO  (via drill 0.33 pad 0.69)
  Top 0.152: 2.85,15.84 2.85,15.24 arc9 2.86,15.14 3,14.27 arc-9 3,14.17 3,13.58 arc-90 2.75,13.33 IC4.17 | 2.85,15.84 v2.85,16.33 | 2.85,15.84 3.02,16.21 v2.85,16.33 | 2.85,15.84 2.63,16.19 v2.85,16.33
  Bottom 0.152: IC3.27 1.39,16.79 arc-37 1.54,16.74 1.58,16.71 arc24 1.96,16.54 arc0 v2.85,16.33 | v2.85,16.33 2.66,16.15 2.36,16.44 2.76,16.58 v2.85,16.33
RF_MOSI  (via drill 0.33 pad 0.69)
  Top 0.152: IC4.14 3.84,14.73 3.84,15.07 arc21 3.83,15.16 3.78,15.27 arc-21 3.77,15.36 3.77,15.84 | 3.77,15.84 v3.77,16.33 | 3.77,15.84 3.94,16.19 v3.77,16.33 | 3.77,15.84 3.59,16.19 v3.77,16.33
  Bottom 0.152: IC3.28 1.4,17.29 arc-45 1.58,17.22 1.63,17.17 arc57 2.24,16.84 arc17 2.57,16.89 arc-54 3.33,16.76 3.42,16.68 | 3.42,16.68 v3.77,16.33 | 3.42,16.68 3.5,16.27 v3.77,16.33 | 3.42,16.68 3.82,16.59 v3.77,16.33
SWCLK  (via drill 0.33 pad 0.69)
  Top 0.152: v1.68,23.37 PAD5.1 | v1.68,23.37 1.61,23.11 1.21,23.23 1.48,23.55 v1.68,23.37
  Bottom 0.152: IC3.37 2.49,23.34 2.18,23.34 | 2.18,23.34 1.71,23.34 v1.68,23.37 | 2.18,23.34 1.84,23.59 v1.68,23.37 | 2.18,23.34 1.81,23.14 v1.68,23.37
SWDIO  (via drill 0.33 pad 0.69)
  Top 0.152: v1.81,22.48 1.33,22.36 | 1.33,22.36 PAD6.1 | 1.33,22.36 1.72,22.23 v1.81,22.48 | 1.33,22.36 1.62,22.66 v1.81,22.48
  Bottom 0.152: 2.16,22.13 2.33,21.95 arc-45 2.52,21.51 2.52,20.7 arc-93 1.94,20.12 arc-31 1.68,20.17 arc0 1.53,20.24 1.43,20.29 IC3.34 | 2.16,22.13 v1.81,22.48 | 2.16,22.13 2.07,22.54 v1.81,22.48 | 2.16,22.13 1.75,22.22 v1.81,22.48
USB_DM  (via drill 0.33 pad 0.69)
  Top 0.152: 1.76,18.65 1.08,18.24 arc59 0.77,17.7 0.77,12.45 arc15 0.79,12.29 1.02,11.45 arc-15 1.05,11.21 1.05,9.53 arc45 1.23,9.09 1.79,8.53 arc-45 2.06,7.87 2.06,4.71 arc45 2.25,4.26 2.89,3.62 arc45 3.34,3.43 4.09,3.43 arc-45 4.54,3.24 4.94,2.84 X6.2 | 1.76,18.65 v2.19,18.9 | 1.76,18.65 2.18,18.63 v2.19,18.9 | 1.76,18.65 1.95,19.02 v2.19,18.9
  Top 0.305: 4.94,2.84 5,2.52 X6.2 5.27,2.78 4.94,2.84
  Bottom 0.152: IC3.32 1.49,19.29 arc-32 1.63,19.25 1.77,19.16 | 1.77,19.16 v2.19,18.9 | 1.77,19.16 1.95,18.79 v2.19,18.9 | 1.77,19.16 2.19,19.16 v2.19,18.9
USB_DP  (via drill 0.33 pad 0.69)
  Top 0.152: v2.5,19.69 2.16,19.67 arc12 2,19.65 | 2,19.65 arc31 1.65,19.45 R3.P$2 0.74,18.54 arc45 0.46,17.87 0.46,12.35 arc16 0.5,12.09 0.69,11.41 arc-16 0.72,11.24 0.72,9.53 arc45 0.99,8.87 1.57,8.29 arc-45 1.76,7.84 1.76,4.68 arc45 2.03,4.02 2.65,3.4 arc45 3.32,3.12 3.4,3.12 arc-16 3.66,3.09 | 3.66,3.09 arc-18 3.93,2.96 v4.1,2.85 | 2,19.65 2.37,19.45 v2.5,19.69 | 2,19.65 2.34,19.9 v2.5,19.69 | 3.66,3.09 3.86,2.72 v4.1,2.85 | 3.66,3.09 4.08,3.11 v4.1,2.85
  Bottom 0.152: IC3.33 1.58,19.79 arc-7 1.62,19.79 2,19.74 | 2,19.74 v2.5,19.69 | v4.1,2.85 4.57,3 | 4.57,3 4.99,3.14 arc-18 5.19,3.18 5.24,3.18 arc-90 5.87,2.54 5.87,1.96 X6.3 | 2,19.74 2.33,19.48 v2.5,19.69 | 2,19.74 2.38,19.9 v2.5,19.69 | 4.57,3 4.16,3.1 v4.1,2.85 | 4.57,3 4.3,2.68 v4.1,2.85
  Bottom 0.305: 5.87,1.96 5.69,1.69 X6.3 6.06,1.69 5.87,1.96
VBUS  (via drill 0.33 pad 0.69)
  Top 0.152: 6.94,24.82 7.91,24.82 arc-28 8.27,24.73 10.42,23.58 arc-62 10.83,22.91 10.83,21.59 10.69,17.49 | D1.A 5.77,28.57 Q1.3 5.9,28.63 6.3,28.1 arc-21 6.42,27.86 6.91,26.22 arc-17 6.94,26 6.94,24.82 | R4.P$1 6.94,24.82 | 10.69,17.49 v10.67,16.99 | 10.69,17.49 10.45,17.14 v10.67,16.99 | 10.69,17.49 10.9,17.13 v10.67,16.99
  Bottom 0.152: v10.67,16.99 10.67,17.02 11.21,14.81 arc-14 11.26,14.39 11.26,12.39 arc-13 11.21,12 10.42,8.51 10.04,7.21 7.8,1.36 arc-71 7.2,0.94 5.82,0.94 arc-30 5.5,1.02 4.92,1.36 X6.1 | v10.67,16.99 10.93,16.91 10.8,16.51 10.49,16.8 v10.67,16.99
  Bottom 0.305: 4.92,1.36 4.78,1.66 X6.1 4.59,1.33 4.92,1.36
VCC  (via drill 0.33 pad 0.69)
  Top 0.152: v1.91,21.54 | C9.P$2 0.92,21.54 arc90 0.67,21.29 0.67,20.14 arc90 0.92,19.89 R3.P$1 | C21.P$2 1.33,12.37 arc-90 1.07,12.62 1.07,14.21 arc-26 1.13,14.48 1.14,14.49 | 1.14,14.49 v1.35,14.94 | v5.26,15.57 5.31,15.75 5.39,16.48 arc-71 5.75,16.89 6.1,16.97 LED1.A | v5.26,15.57 5.07,15.75 5.35,16.06 5.48,15.67 v5.26,15.57 | 1.14,14.49 1.49,14.71 v1.35,14.94 | 1.14,14.49 1.09,14.9 v1.35,14.94
  Top 0.203: C9.P$2 1.42,21.54 | 1.42,21.54 v1.91,21.54 2.41,21.54 | C8.P$1 2.41,21.54 | 6.31,19.95 6.29,19.95 arc-45 6.11,20.03 6.02,20.12 arc-45 5.95,20.3 5.95,20.69 arc16 5.92,20.87 5.53,22.18 IC2.8 5.53,22.82 C1.P$2 5.29,23.49 5.29,23.58 arc68 5.13,23.81 v4.15,24.21 | v8.52,17.17 8.02,17.17 | 8.02,17.17 7.96,17.17 C7.P$2 | 6.31,19.95 6.31,18.57 6.28,18.54 R6.P$2 6.25,18.4 | 6.31,19.95 IC2.1 | v6.25,17.91 6.25,18.4 | v6.25,17.91 6.25,17.41 | 6.25,17.41 6.25,17.14 LED1.A | C8.P$1 2.65,22.02 2.27,23.7 arc-61 2.47,24.32 v2.93,24.71 | IC2.13 2.65,21.95 C8.P$1 | C4.P$2 3.91,25.47 3.71,25.27 3.33,25 | 3.33,25 v2.93,24.71 | IC4.19 1.6,12.33 C21.P$2 | 1.42,21.54 1.79,21.33 v1.91,21.54 | 1.42,21.54 1.79,21.75 v1.91,21.54 | 2.41,21.54 2.03,21.75 v1.91,21.54 | 2.41,21.54 2.03,21.33 v1.91,21.54 | 8.02,17.17 8.4,16.96 v8.52,17.17 | 8.02,17.17 8.4,17.38 v8.52,17.17 | 6.25,18.4 6.04,18.02 v6.25,17.91 | 6.25,18.4 6.46,18.02 v6.25,17.91 | 6.25,17.41 6.46,17.79 v6.25,17.91 | 6.25,17.41 6.04,17.79 v6.25,17.91 | v2.93,24.71 2.95,24.55 2.56,24.39 2.7,24.8 v2.93,24.71 | 3.33,25 2.9,24.95 v2.93,24.71 | 3.33,25 3.14,24.61 v2.93,24.71 | v4.15,24.21 4.33,24.36 4.61,24.02 4.18,23.97 v4.15,24.21
  Top 0.61: IC1.2 C4.P$2
  Bottom 0.152: 2.49,14.94
  Bottom 0.203: 1.38,21.29 IC3.36 1.48,21.29 | C6.P$2 2.44,13.7 arc35 2.49,13.84 IC3.24 2.49,14.94 1.85,14.94 | 1.48,21.29 1.66,21.29 v1.91,21.54 | IC3.1 9.49,21.92 arc-39 9.63,22.32 9.7,22.4 | 9.7,22.4 JP2.2 | JP2.2 9.54,23.48 arc49 8.79,23.83 C10.P$2 8.06,23.37 arc45 7.99,23.19 IC3.48 | 9,17.29 IC3.9 9.94,17.29 arc90 10.32,17.67 10.32,18.5 arc-11 10.35,18.84 10.82,21.24 arc11 10.85,21.58 10.85,22 arc47 10.75,22.23 10.52,22.45 | 9,17.29 8.81,17.29 v8.52,17.17 | JP2.2 10.52,22.45 | v2.93,24.71 3.69,24.4 | 3.69,24.4 v4.15,24.21 | v6.25,17.91 6.73,17.75 | 6.73,17.75 v8.52,17.17 | v5.26,15.57 4.78,15.48 | 4.78,15.48 2.79,15.09 arc26 2.53,14.97 2.49,14.94 | v1.35,14.94 1.85,14.94 | 1.48,21.29 1.91,21.3 v1.91,21.54 | 1.48,21.29 1.7,21.66 v1.91,21.54 | 9,17.29 8.58,17.4 v8.52,17.17 | 9,17.29 8.68,17 v8.52,17.17 | v8.52,17.17 8.34,17.01 8.04,17.32 8.47,17.41 v8.52,17.17 | 6.73,17.75 6.43,18.07 v6.25,17.91 | 6.73,17.75 6.3,17.67 v6.25,17.91 | v2.93,24.71 3.12,24.86 3.38,24.52 2.95,24.47 v2.93,24.71 | 3.69,24.4 3.96,24.06 v4.15,24.21 | 3.69,24.4 4.12,24.45 v4.15,24.21 | 4.78,15.48 5.19,15.34 v5.26,15.57 | 4.78,15.48 5.11,15.76 v5.26,15.57 | 1.85,14.94 1.47,15.15 v1.35,14.94 | 1.85,14.94 1.47,14.72 v1.35,14.94 | 9.7,22.4 10.18,22.58 | 9.7,22.4 9.78,22.91 JP2.2 | JP2.2 9.78,22.81 9.68,23.31 10.17,23.15 JP2.2 | 10.52,22.45 10.37,22.95 | 10.52,22.45 10.01,22.56 JP2.2
  Bottom 0.406: 10.18,22.58 JP2.2 10.37,22.95

### Text on the board
_tNames: + | Bat
_bNames: USB
_tValues: M3 | M1 | M4 | M2 | Boot | RX | TX | RX | Bind | ANT | EachiWhoop | v2
_bValues: + | TX